# Altium schematic sheet MCU.SchDoc
size A3; SheetNumber: 13; SheetTotal: 18
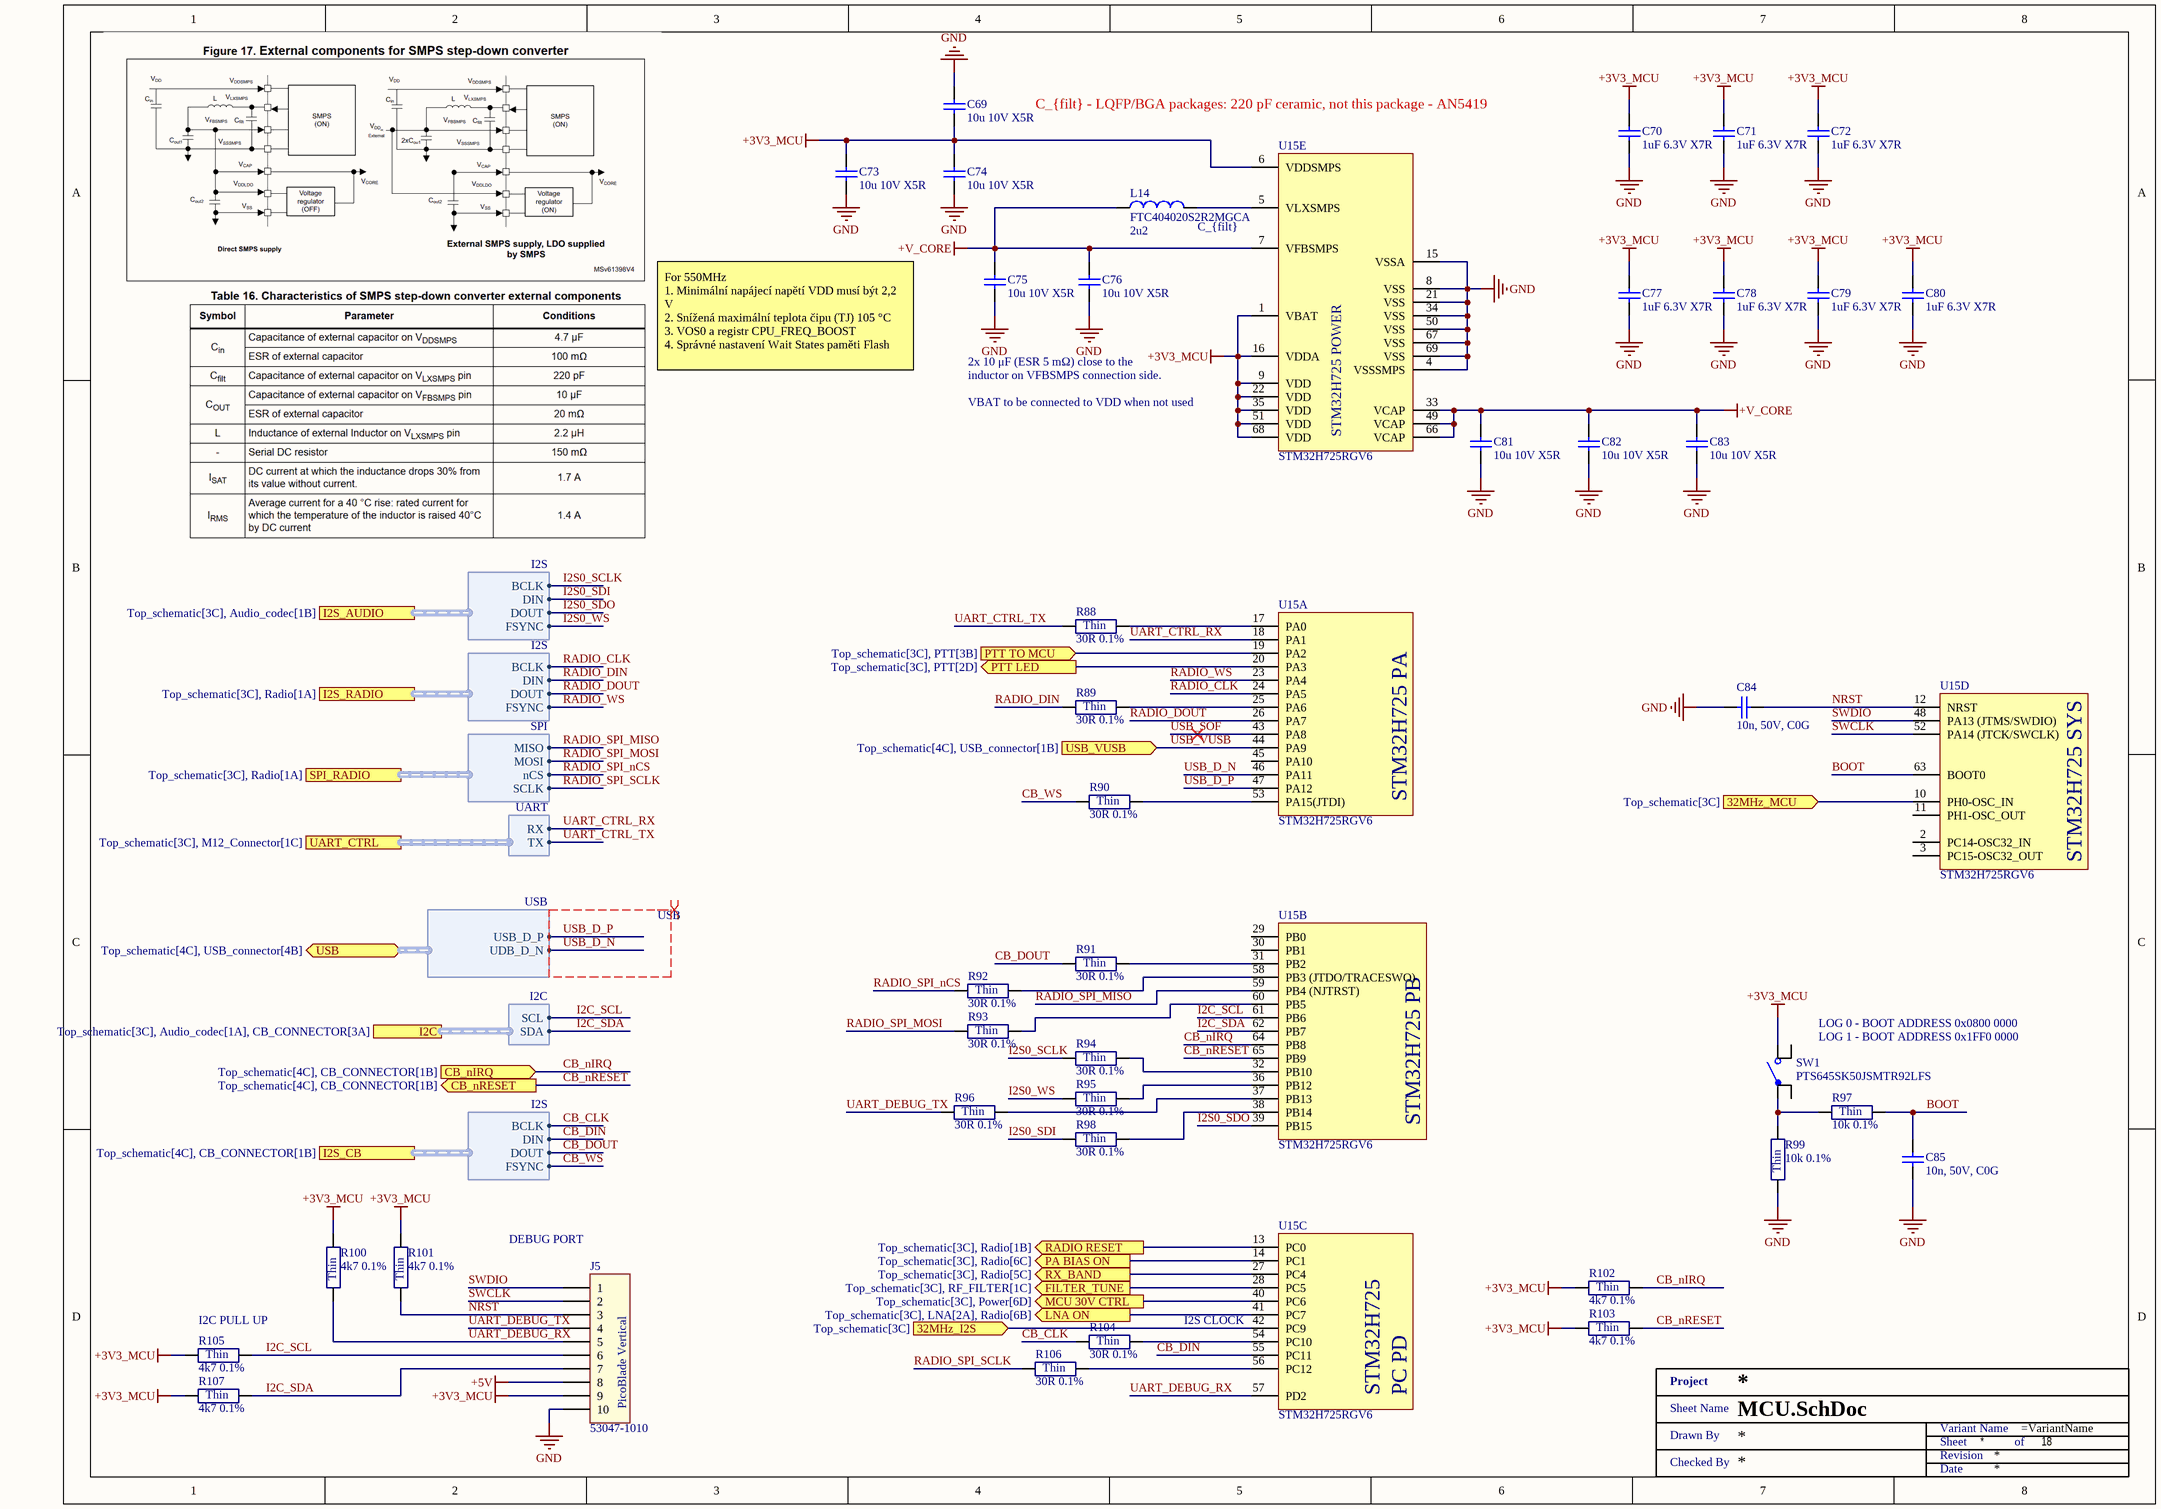
[diagram p0: MCU.SchDoc]

## Parts
C69  10u 10V X5R  [SMD0603]
C70  1uF 6.3V X7R  [SMD0402]
C71  1uF 6.3V X7R  [SMD0402]
C72  1uF 6.3V X7R  [SMD0402]
C73  10u 10V X5R  [SMD0603]
C74  10u 10V X5R  [SMD0603]
C75  10u 10V X5R  [SMD0603]
C76  10u 10V X5R  [SMD0603]
C77  1uF 6.3V X7R  [SMD0402]
C78  1uF 6.3V X7R  [SMD0402]
C79  1uF 6.3V X7R  [SMD0402]
C80  1uF 6.3V X7R  [SMD0402]
C81  10u 10V X5R  [SMD0603]
C82  10u 10V X5R  [SMD0603]
C83  10u 10V X5R  [SMD0603]
C84  10n, 50V, C0G  [SMD0603]
C85  10n, 50V, C0G  [SMD0603]
J5  53047-1010  [530471010]
L14  FTC404020S2R2MGCA  Inductance: 2u2  [FTC404020S]
R88  30R 0.1%  [SMD0402 - R]
R89  30R 0.1%  [SMD0402 - R]
R90  30R 0.1%  [SMD0402 - R]
R91  30R 0.1%  [SMD0402 - R]
R92  30R 0.1%  [SMD0402 - R]
R93  30R 0.1%  [SMD0402 - R]
R94  30R 0.1%  [SMD0402 - R]
R95  30R 0.1%  [SMD0402 - R]
R96  30R 0.1%  [SMD0402 - R]
R97  10k 0.1%  [SMD0402 - R]
R98  30R 0.1%  [SMD0402 - R]
R99  10k 0.1%  [SMD0402 - R]
R100  4k7 0.1%  [SMD0402 - R]
R101  4k7 0.1%  [SMD0402 - R]
R102  4k7 0.1%  [SMD0402 - R]
R103  4k7 0.1%  [SMD0402 - R]
R104  30R 0.1%  [SMD0402 - R]
R105  4k7 0.1%  [SMD0402 - R]
R106  30R 0.1%  [SMD0402 - R]
R107  4k7 0.1%  [SMD0402 - R]
SW1  PTS645SK50JSMTR92LFS  [J Square Actuator 6X6]
U15  STM32H725RGV6  [VFQFPN68-800X800X80_HS-69N]  (parts A,B,C,D,E of 5)
XX?  Title 1  (value not drawn)  (graphical)

## Ports
32MHz_I2S (in, see Top_schematic[3C]), 32MHz_MCU (in, see Top_schematic[3C]), CB_nIRQ (in, see Top_schematic[4C], CB_CONNECTOR[1B]), CB_nRESET (out, see Top_schematic[4C], CB_CONNECTOR[1B]), FILTER_TUNE (out, see Top_schematic[3C], RF_FILTER[1C]), I2C (harness I2C, see Top_schematic[3C], Audio_codec[1A], CB_CONNECTOR[3A]), I2S_AUDIO (harness I2S, see Top_schematic[3C], Audio_codec[1B]), I2S_CB (harness I2S, see Top_schematic[4C], CB_CONNECTOR[1B]), I2S_RADIO (harness I2S, see Top_schematic[3C], Radio[1A]), LNA ON (out, see Top_schematic[3C], LNA[2A], Radio[6B]), MCU 30V CTRL (out, see Top_schematic[3C], Power[6D]), PA BIAS ON (out, see Top_schematic[3C], Radio[6C]), PTT LED (out, see Top_schematic[3C], PTT[2D]), PTT TO MCU (in, see Top_schematic[3C], PTT[3B]), RADIO RESET (out, see Top_schematic[3C], Radio[1B]), RX_BAND (out, see Top_schematic[3C], Radio[5C]), SPI_RADIO (harness SPI, see Top_schematic[3C], Radio[1A]), UART_CTRL (harness UART, see Top_schematic[3C], M12_Connector[1C]), USB (bidir, harness USB, see Top_schematic[4C], USB_connector[4B]), USB_VUSB (in, see Top_schematic[4C], USB_connector[1B])

## Harnesses
I2S: BCLK, DIN, DOUT, FSYNC
SPI: MISO, MOSI, nCS, SCLK
UART: RX, TX
USB: USB_D_P, UDB_D_N
I2C: SCL, SDA

## Nets
+3V3_MCU: C69.1 C70.2 C71.2 C72.2 C73.2 C74.2 C77.2 C78.2 C79.2 C80.2 J5.9 R100.2 R101.2 R102.1 R103.1 R105.1 R107.1 SW1.3(C) U15.1(VBAT) U15.6(VDDSMPS) U15.9(VDD) U15.16(VDDA) U15.22(VDD) U15.35(VDD) U15.51(VDD) U15.68(VDD)
+5V: J5.8
+V_CORE: C75.2 C76.2 C81.2 C82.2 C83.2 L14.1 U15.7(VFBSMPS) U15.33(VCAP) U15.49(VCAP) U15.66(VCAP)
GND: C69.2 C70.1 C71.1 C72.1 C73.1 C74.1 C75.1 C76.1 C77.1 C78.1 C79.1 C80.1 C81.1 C82.1 C83.1 C84.2 C85.2 J5.10 R99.1 U15.4(VSSSMPS) U15.8(VSS) U15.15(VSSA) U15.21(VSS) U15.34(VSS) U15.50(VSS) U15.67(VSS) U15.69(VSS)
32MHz_I2S: U15.42(PC9) ; port 32MHz_I2S
32MHz_MCU: U15.10(PH0-OSC_IN) ; port 32MHz_MCU
BOOT: C85.1 R97.2 U15.63(BOOT0)
CB_CLK: R104.1 ; port I2S_CB.BCLK
CB_DIN: U15.55(PC11) ; port I2S_CB.DIN
CB_DOUT: R91.1 ; port I2S_CB.DOUT
CB_nIRQ: R102.2 U15.64(PB8) ; port CB_nIRQ
CB_nRESET: R103.2 U15.65(PB9) ; port CB_nRESET
CB_WS: R90.1 ; port I2S_CB.FSYNC
FILTER_TUNE: U15.28(PC5) ; port FILTER_TUNE
I2C_SCL: J5.6 R105.2 U15.61(PB6) ; port I2C.SCL
I2C_SDA: J5.7 R107.2 U15.62(PB7) ; port I2C.SDA
I2S0_SCLK: R94.1 ; port I2S_AUDIO.BCLK
I2S0_SDI: R98.1 ; port I2S_AUDIO.DIN
I2S0_SDO: U15.39(PB15) ; port I2S_AUDIO.DOUT
I2S0_WS: R95.1 ; port I2S_AUDIO.FSYNC
LNA ON: U15.41(PC7) ; port LNA ON
MCU 30V CTRL: U15.40(PC6) ; port MCU 30V CTRL
NRST: C84.1 J5.3 R101.1 U15.12(NRST)
PA BIAS ON: U15.14(PC1) ; port PA BIAS ON
PTT LED: U15.20(PA3) ; port PTT LED
PTT TO MCU: U15.19(PA2) ; port PTT TO MCU
RADIO RESET: U15.13(PC0) ; port RADIO RESET
RADIO_CLK: U15.24(PA5) ; port I2S_RADIO.BCLK
RADIO_DIN: R89.1 ; port I2S_RADIO.DIN
RADIO_DOUT: U15.26(PA7) ; port I2S_RADIO.DOUT
RADIO_SPI_MISO: U15.59(PB4_(NJTRST)) ; port SPI_RADIO.MISO
RADIO_SPI_MOSI: R93.1 ; port SPI_RADIO.MOSI
RADIO_SPI_nCS: R92.1 ; port SPI_RADIO.nCS
RADIO_SPI_SCLK: R106.1 ; port SPI_RADIO.SCLK
RADIO_WS: U15.23(PA4) ; port I2S_RADIO.FSYNC
RX_BAND: U15.27(PC4) ; port RX_BAND
SWCLK: J5.2 U15.52(PA14_(JTCK/SWCLK))
SWDIO: J5.1 U15.48(PA13_(JTMS/SWDIO))
UART_CTRL_RX: U15.18(PA1) ; port UART_CTRL.RX
UART_CTRL_TX: R88.1 ; port UART_CTRL.TX
UART_DEBUG_RX: J5.5 R100.1 U15.57(PD2)
UART_DEBUG_TX: J5.4 R96.1
USB_D_N: U15.46(PA11) ; port USB.UDB_D_N
USB_D_P: U15.47(PA12) ; port USB.USB_D_P
USB_SOF: U15.43(PA8)
USB_VUSB: U15.44(PA9) ; port USB_VUSB
NetL14_2: L14.2 U15.5(VLXSMPS)
NetR88_2: R88.2 U15.17(PA0)
NetR89_2: R89.2 U15.25(PA6)
NetR90_2: R90.2 U15.53(PA15(JTDI))
NetR91_2: R91.2 U15.31(PB2)
NetR92_2: R92.2 U15.58(PB3_(JTDO/TRACESWO))
NetR93_2: R93.2 U15.60(PB5)
NetR94_2: R94.2 U15.32(PB10)
NetR95_2: R95.2 U15.36(PB12)
NetR96_2: R96.2 U15.37(PB13)
NetR97_1: R97.1 R99.2 SW1.1(A)
NetR98_2: R98.2 U15.38(PB14)
NetR104_2: R104.2 U15.54(PC10)
NetR106_2: R106.2 U15.56(PC12)

Not connected (* = marked no-connect by the designer): SW1 2(B) 4(D); U15 2(PC14-OSC32_IN) 3(PC15-OSC32_OUT) 11(PH1-OSC_OUT) 29(PB0) 30(PB1) 45(PA10)

## Layout directives
differential pair; differential pair class USB: USB_D_N, USB_D_P

## Notes on the sheet
- C_{filt} - LQFP/BGA packages: 220 pF ceramic, not this package - AN5419
- C_{filt}
- For 550MHz
  1. Minimální napájecí napětí VDD musí být 2,2 V
  2. Snížená maximální teplota čipu (TJ) 105 °C
  3. VOS0 a registr CPU_FREQ_BOOST
  4. Správné nastavení Wait States paměti Flash
- 2x 10 μF (ESR 5 mΩ) close to the
- inductor on VFBSMPS connection side.
- VBAT to be connected to VDD when not used
- (near SW1) LOG 0 - BOOT ADDRESS 0x0800 0000
- (near SW1) LOG 1 - BOOT ADDRESS 0x1FF0 0000
- (near J5) DEBUG PORT
- (near R105) I2C PULL UP
- I2S CLOCK
- (in symbol 53047-1010) PicoBlade Vertical
- (in symbol RT0402BRD074K7L) Thin
- (in symbol STM32H725RGV6, part A) STM32H725 PA
- (in symbol STM32H725RGV6, part B) STM32H725 PB
- (in symbol STM32H725RGV6, part C) STM32H725; PC PD
- (in symbol STM32H725RGV6, part D) STM32H725 SYS
- (in symbol STM32H725RGV6, part E) STM32H725 POWER
- (in symbol TC0225B300JTCC) Thin
- (in symbol TC0225B1002TCC) Thin
- (in symbol Title 1) Project; Sheet Name; Variant Name; Drawn By; Sheet; of; Revision; Checked By; Date

## Library data of the parts
C69 C73-C76 C81-C83 = TCC0603X5R106K100CT: Multilayer Ceramic Capacitor (MLCC) 10uF ±10% 10V X5R 0603 SMD, CCTC TCC Series; Capacitance: 10u; Supplier 1: LCSC; Supplier Part Number 1: C380314
C70-C72 C77-C80 = TCC0402X7R105K6R3AT: Capacitor: MLCC; SMD; 0402; 1µF; 6.3V; ±10%; X7R; CCTC; Capacitance: 1u; Supplier 1: LCSC; Supplier Part Number 1: C5448871; Manufacturer: CCTC; Manufacturer Part Number: TCC0402X7R105K6R3AT; Category: Ceramic Capacitors; Stock 1: 242350; Pricing 1: 50=0.0089, 500=0.0072, 1500=0.0063, 10000=0.0058, 20000=0.0053, 50000=0.005 (USD); ComponentLink1URL: https://datasheet.octopart.com:443/TCC0402X7R105K6R3AT-CCTC-datasheet-194166649.pdf?src-supplier=LCSC; ComponentLink1Description: https://datasheet.octopart.com:443/TCC0402X7R105K6R3AT-CCTC-datasheet-194166649.pdf?src-supplier=LCSC; ComponentLink2URL: https://datasheet.octopart.com:443/TCC0402X7R105K6R3AT-CCTC-datasheet-192317456.pdf?src-supplier=HQonline; ComponentLink2Description: https://datasheet.octopart.com:443/TCC0402X7R105K6R3AT-CCTC-datasheet-192317456.pdf?src-supplier=HQonline
C84 C85 = GRM1885C1H103JA01D: Multilayer Ceramic Capacitors MLCC - SMD/SMT 0603 50VDC 10000pF 5% C0G; Manufacturer: Murata Electronics; Type: Chip Multilayer Ceramic Capacitor for General Purpose; Capacitance - nF: 10 nF; Class: Class 1; CNHTS: 8532241000; Dielectric: C0G (NP0); TARIC: 8532240000; Supplier 1: Mouser; Supplier Part Number 1: 81-GRM1885C1H103JA1D; Manufacturer Part Number: GRM1885C1H103JA01D; RoHS: RoHS Compliant; Category: Multilayer Ceramic Capacitors MLCC - SMD/SMT; Stock 1: 217291; Pricing 1: 1=0.183, 10=0.129, 100=0.065, 500=0.045, 1000=0.039, 4000=0.030, 8000=0.027, 24000=0.025 (EUR); Capacitance: 10n; Height: 0.8 mm; Length: 1.6 mm; Package / Case: 0603 (1608 metric); Packaging: Cut Tape; Product: General Type MLCCs; Series: GRM; Termination Style: SMD/SMT; Tolerance: 5 %; Voltage Rating DC: 50 VDC; Width: 0.8 mm; Brand: Murata Electronics; Capacitance - pF: 10000 pF; Case Code - in: 0603; Case Code - mm: 1608; HTS Code: 8532240020; Maximum Operating Temperature: + 125 C; Minimum Operating Temperature: - 55 C; Product Type: Ceramic Capacitors; Standard Pack Qty: 4000; Subcategory: Capacitors; Termination: Standard; RoHS - Mouser: Y; Minimum Order Quantity: 1; Reeling: True; ComponentLink1URL: http://www.mouser.com/datasheet/2/281/murata_03052018_GRM_Series_1-1310166.pdf; ComponentLink1Description: http://www.mouser.com/datasheet/2/281/murata_03052018_GRM_Series_1-1310166.pdf; Supplier 2: Farnell; Supplier Part Number 2: 2456107
J5 = 53047-1010: 1.25mm Pitch, PicoBlade PCB Header, Single Row, Vertical, Through Hole, Tin Plating, Friction Lock, 10 Circuits, Tray, 2.30mm PC Tail Length; Manufacturer: Molex; Number of Contacts: 10; Max Voltage Rating (DC): 125.125kV; Max Voltage Rating (AC): 125V; Current Rating: 1A; Contact Resistance: 20MR; Insulation Resistance: 100MR; Glow Wire Compliant: Non-compliant; Connector Type: Blade Pin; Supplier 1: Mouser; Supplier Part Number 1: 538-53047-1010; Manufacturer Part Number: 53047-1010; Stock 1: 9729; Pricing 1: 1 = 0.50000, 10 = 0.48800, 50 = 0.48800, 100 = 0.37400, 1000 = 0.26800, 10000 = 0.21600 (USD); RoHS: Yes; Mount: Through Hole; Contact Plating: Tin; Contact Material: Bronze; Housing Color: White; Color: Natural; Housing Material: Nylon; Body Plating: Tin; Plating: Tin; Min Operating Temperature: -40°C; Max Operating Temperature: 85°C; Termination: Solder; Number of Rows: 1; Orientation: Vertical; Packaging: Tray; Number of Positions: 10; Package Quantity: 2000; Voltage Rating: 125V; Max Current Rating: 1A; Number of Poles: 10; Voltage Rating (AC): 125V; Contact Gender: Male; Working Voltage: 125V; Current: 1A; Voltage: 125V; Number of Circuits: 10; Voltage Rating (DC): 125V; Length: 14.25mm; Height: 4.2mm; Pitch: 1.25mm; Depth: 3.2mm; Lead Pitch: 1.25mm; Radiation Hardening: No; REACH SVHC: Unknown; Lead Free: Lead Free; Flammability Rating: UL94 V-0; ComponentLink1URL: https://datasheet.ciiva.com/5151/0530471010-pcb-headers-171035-5151940.pdf?src-supplier=Mouser; ComponentLink1Description: https://datasheet.ciiva.com/5151/0530471010-pcb-headers-171035-5151940.pdf?src-supplier=Mouser; ComponentLink2URL: https://datasheet.ciiva.com/30250/7280530471010-pcb-headers-30250345.pdf?src-supplier=Onlinecomponents.com; ComponentLink2Description: https://datasheet.ciiva.com/30250/7280530471010-pcb-headers-30250345.pdf?src-supplier=Onlinecomponents.com; ComponentLink3URL: https://datasheet.ciiva.com/11747/0900766b8024e2fd-11747087.pdf?src-supplier=RSComponents; ComponentLink3Description: https://datasheet.ciiva.com/11747/0900766b8024e2fd-11747087.pdf?src-supplier=RSComponents; ComponentLink4URL: https://datasheet.ciiva.com/19461/2033252-19461670.pdf?src-supplier=Jameco; ComponentLink4Description: https://datasheet.ciiva.com/19461/2033252-19461670.pdf?src-supplier=Jameco; ComponentLink5URL: https://datasheet.ciiva.com/10083/0530471010-pcb-headers-10083962.pdf?src-supplier=Avnet; ComponentLink5Description: https://datasheet.ciiva.com/10083/0530471010-pcb-headers-10083962.pdf?src-supplier=Avnet; ComponentLink6URL: https://datasheet.ciiva.com/20207/22-3930e-20207531.pdf?src-supplier=Rapid+Electronics; ComponentLink6Description: https://datasheet.ciiva.com/20207/22-3930e-20207531.pdf?src-supplier=Rapid+Electronics; Supplier 2: Arrow; Supplier Part Number 2: 53047-1010; Stock 2: 19420; Pricing 2: 1 = 0.41890, 10 = 0.39900, 100 = 0.30530, 500 = 0.27600, 1000 = 0.24010, 8000 = 0.20770, 1 = 0.56870, 10 = 0.52970, 100 = 0.36620, 500 = 0.31550, 1000 = 0.26830, 100 = 0.37250 (USD); Supplier 3: Digi-Key; Supplier Part Number 3: WM1739-ND; Stock 3: 4931; Pricing 3: 1 = 0.52000, 10 = 0.48900, 100 = 0.37470, 500 = 0.32580, 1000 = 0.26879, 8000 = 0.21992, 16000 = 0.21666 (USD); Supplier 4: Farnell; Supplier Part Number 4: 9733086; Stock 4: 12753; Supplier 5: Mouser; Supplier Part Number 5: 538-53047-0410; Category: Headers and Wire Housings; Stock 5: 7971; Pricing 5: 1=0,27000, 10=0,23400, 100=0,18000, 500=0,15400, 1000=0,13000, 5000=0,11200, 10000=0,10400 (USD); Contact Mating Length: 0.089inch; ComponentLink7URL: https://datasheet.ciiva.com/3934/87920530470410-pcb-headers-3934064.pdf?src-supplier=Arrow; ComponentLink7Description: https://datasheet.ciiva.com/3934/87920530470410-pcb-headers-3934064.pdf?src-supplier=Arrow
L14 = FTC404020S2R2MGCA: FIXED IND 2.2uH 5.5A 36mΩ SMD,4.1x4.1mm; Manufacturer: Cjiang; Supplier 1: LCSC; Supplier Part Number 1: C39676070; Manufacturer Part Number: FTC404020S2R2MGCA; Category: Uncategorized; Stock 1: 6495; Pricing 1: 5=0.2588, 50=0.1952, 150=0.1679, 500=0.134, 3000=0.1188, 6000=0.1097 (USD)
R88-R96 R98 R104 R106 = TC0225B300JTCC: Resistor: thin film; SMD; 0402; 30Ω; 62.5mW; ±0.1%; TC25; 25V; -55÷155°C; Manufacturer: Uniroyal; Supplier 1: LCSC; Supplier Part Number 1: C50670254; Manufacturer Part Number: TC0225B300JTCC; Category: Uncategorized; Stock 1: 4950; Pricing 1: 50=0.0203, 500=0.0161, 1500=0.0137, 10000=0.0123, 20000=0.0111, 50000=0.0104 (USD); ComponentLink1URL: https://datasheet.octopart.com:443/TC0225B300JTCC-Uniroyal-datasheet-194228366.pdf?src-supplier=LCSC; ComponentLink1Description: https://datasheet.octopart.com:443/TC0225B300JTCC-Uniroyal-datasheet-194228366.pdf?src-supplier=LCSC; Resistance: 30R
R97 R99 = TC0225B1002TCC: Fixed Resistor, Thin Film, 0.0625W, 10000ohm, 50V, 0.1% +/-Tol, Surface Mount, 0402; Manufacturer: Uniroyal; Power Rating: 62.5mW; Supplier 1: LCSC; Supplier Part Number 1: C2989267; Manufacturer Part Number: TC0225B1002TCC; Category: Chip SMD Resistors; Stock 1: 10200; Pricing 1: 20=0.0396, 200=0.0352, 600=0.0327, 2000=0.0312, 10000=0.0299, 20000=0.0292 (USD); Case/Package: 0402; Composition: Thin Film; Export Control Classification Number (ECCN) Code: EAR99; Height: 300µm; Harmonized Tariff Schedule (HTS) Code: 8533.21.00.30; Length: 1mm; Lifecycle Status: Production; Max Operating Temperature: 155°C; Min Operating Temperature: -55°C; Mounting Technology: Surface Mount; Number of Terminals: 2; Resistance: 10k; Tolerance: 0.1%; Width: 500µm; Working Voltage: 50V; ComponentLink1URL: https://datasheet.octopart.com:443/TC0225B1002TCC-Uniroyal-datasheet-194228365.pdf?src-supplier=LCSC; ComponentLink1Description: https://datasheet.octopart.com:443/TC0225B1002TCC-Uniroyal-datasheet-194228365.pdf?src-supplier=LCSC
R100-R103 R105 R107 = RT0402BRD074K7L: 62.5mW Thin Film Resistor 50V ±25ppm/℃ ±0.1% 4.7kΩ 0402 Chip Resistor - Surface Mount ROHS; Manufacturer: Yageo Group; Max Power Dissipation: 63mW; Temperature Coefficient: 25ppm/°C; Supplier: Mouser; Supplier Part Number: 603-RT0402BRD074K7L; Manufacturer Part Number: RT0402BRD074K7L; RoHS: Compliant; Category: Chip SMD Resistors; Stock: 24860; Pricing: 1=0,1, 10=0,069, 50=0,069, 100=0,065, 1000=0,054, 10000=0,048 (USD); Case/Package: 0402; Case Code (Imperial): 0402; China RoHS: Non-Compliant; Composition: Thin Film; Depth: 500µm; Features: Moisture Resistant; Height: 300µm; Lead Free: Lead Free; Length: 1mm; Lifecycle Status: Production; Max Operating Temperature: 155°C; Military Standard: Not; Min Operating Temperature: -55°C; Mounting Technology: Surface Mount; Number of Terminals: 2; Number of Terminations: 2; Power Rating: 62.5mW; REACH SVHC: Yes; Schedule B: 8533210045, 8533210045|8533210045|8533210045|8533210045|8533210045; Termination: SMD/SMT; Tolerance: 0.1%; Voltage Rating: 50V; Voltage Rating (DC): 50V; Width: 500µm; Working Voltage: 50V; ComponentLink1URL: https://datasheet.octopart.com:443/RT0402BRD074K7L-Yageo-datasheet-176402239.pdf?src-supplier=Future+Electronics; ComponentLink1Description: https://datasheet.octopart.com:443/RT0402BRD074K7L-Yageo-datasheet-176402239.pdf?src-supplier=Future+Electronics; ComponentLink2URL: https://datasheet.octopart.com:443/RT0402BRD074K7L-Yageo-datasheet-169971040.pdf?src-supplier=Future+Electronics; ComponentLink2Description: https://datasheet.octopart.com:443/RT0402BRD074K7L-Yageo-datasheet-169971040.pdf?src-supplier=Future+Electronics; ComponentLink3URL: https://datasheet.octopart.com:443/RT0402BRD074K7L-Yageo-datasheet-166250672.pdf?src-supplier=Future+Electronics; ComponentLink3Description: https://datasheet.octopart.com:443/RT0402BRD074K7L-Yageo-datasheet-166250672.pdf?src-supplier=Future+Electronics; ComponentLink4URL: https://datasheet.octopart.com:443/RT0402BRD074K7L-Yageo-datasheet-136673517.pdf?src-supplier=Future+Electronics; ComponentLink4Description: https://datasheet.octopart.com:443/RT0402BRD074K7L-Yageo-datasheet-136673517.pdf?src-supplier=Future+Electronics; ComponentLink5URL: https://datasheet.octopart.com:443/RT0402BRD074K7L-Yageo-datasheet-137700930.pdf?src-supplier=Future+Electronics; ComponentLink5Description: https://datasheet.octopart.com:443/RT0402BRD074K7L-Yageo-datasheet-137700930.pdf?src-supplier=Future+Electronics; ComponentLink6URL: https://datasheet.octopart.com:443/RT0402BRD074K7L-Yageo-datasheet-96443642.pdf?src-supplier=Upverter; ComponentLink6Description: https://datasheet.octopart.com:443/RT0402BRD074K7L-Yageo-datasheet-96443642.pdf?src-supplier=Upverter; ComponentLink7URL: https://datasheet.octopart.com:443/RT0402BRD074K7L-Yageo-Group-datasheet-188167888.pdf?src-supplier=TME; ComponentLink7Description: https://datasheet.octopart.com:443/RT0402BRD074K7L-Yageo-Group-datasheet-188167888.pdf?src-supplier=TME; ComponentLink8URL: https://datasheet.octopart.com:443/RT0402BRD074K7L-Yageo-datasheet-164439670.pdf?src-supplier=Newark; ComponentLink8Description: https://datasheet.octopart.com:443/RT0402BRD074K7L-Yageo-datasheet-164439670.pdf?src-supplier=Newark; ComponentLink9URL: https://datasheet.octopart.com/RT0402BRD074K7L-Yageo-datasheet-86813807.pdf; ComponentLink9Description: https://datasheet.octopart.com/RT0402BRD074K7L-Yageo-datasheet-86813807.pdf; ComponentLink10URL: http://sigma.octopart.com:80/conflict_mineral_statement/Yageo-company-3.pdf?src-supplier=Compliance+Statements; ComponentLink10Description: http://sigma.octopart.com:80/conflict_mineral_statement/Yageo-company-3.pdf?src-supplier=Compliance+Statements; ComponentLink11URL: http://sigma.octopart.com:80/rohs_statement/Yageo-company-2.pdf?src-supplier=Compliance+Statements; ComponentLink11Description: http://sigma.octopart.com:80/rohs_statement/Yageo-company-2.pdf?src-supplier=Compliance+Statements; Supplier 1: Mouser; Supplier Part Number 1: 603-RT0402BRD074K7L; Supplier 2: LCSC; Supplier Part Number 2: C281778; Resistance: 4k7
SW1 = PTS645SK50JSMTR92LFS: Switch Tactile SPST N.O Round Button 12V 50mA 2.5N Solder Surface Mount T/R; Manufacturer: C&K Components; Supplier: Mouser; Supplier Part Number: 611-SK50JSMTR92LFS; Manufacturer Part Number: PTS645SK50JSMTR92LFS; RoHS: Compliant; Category: Tactile Switches; Stock: 6240; Pricing: 1=0,51, 10=0,437, 50=0,408, 100=0,364, 1000=0,268, 10000=0,234 (USD); Export Control Classification Number (ECCN) Code: EAR99; Harmonized Tariff Schedule (HTS) Code: 8536.50.70.00; Introduction Date: 2022-04-14; Lifecycle Status: Production; REACH SVHC: Yes; ComponentLink1URL: https://datasheet.octopart.com:443/PTS645SK50JSMTR92LFS-C%26K-Components-datasheet-169841344.pdf?src-supplier=IHS; ComponentLink1Description: https://datasheet.octopart.com:443/PTS645SK50JSMTR92LFS-C%26K-Components-datasheet-169841344.pdf?src-supplier=IHS; ComponentLink2URL: https://datasheet.octopart.com:443/PTS645SK50JSMTR92LFS-C%26K-Components-datasheet-165782998.pdf?src-supplier=Farnell; ComponentLink2Description: https://datasheet.octopart.com:443/PTS645SK50JSMTR92LFS-C%26K-Components-datasheet-165782998.pdf?src-supplier=Farnell; ComponentLink3URL: https://datasheet.octopart.com:443/PTS645SK50JSMTR92LFS-C%26K-Components-datasheet-155912617.pdf?src-supplier=Sager+Electronics; ComponentLink3Description: https://datasheet.octopart.com:443/PTS645SK50JSMTR92LFS-C%26K-Components-datasheet-155912617.pdf?src-supplier=Sager+Electronics; ComponentLink4URL: https://datasheet.octopart.com:443/PTS645SK50JSMTR92LFS-C%26K-Components-datasheet-150821959.pdf?src-supplier=Sager+Electronics; ComponentLink4Description: https://datasheet.octopart.com:443/PTS645SK50JSMTR92LFS-C%26K-Components-datasheet-150821959.pdf?src-supplier=Sager+Electronics; ComponentLink5URL: https://datasheet.octopart.com:443/PTS645SK50JSMTR92LFS-C%26K-Components-datasheet-67873720.pdf?src-supplier=Sager+Electronics; ComponentLink5Description: https://datasheet.octopart.com:443/PTS645SK50JSMTR92LFS-C%26K-Components-datasheet-67873720.pdf?src-supplier=Sager+Electronics; ComponentLink6URL: http://sigma.octopart.com:80/reach_statement/ITT-company-18.pdf?src-supplier=Compliance+Statements; ComponentLink6Description: http://sigma.octopart.com:80/reach_statement/ITT-company-18.pdf?src-supplier=Compliance+Statements; Supplier 1: Mouser; Supplier Part Number 1: 611-SK50JSMTR92LFS; Supplier 2: Farnell; Supplier Part Number 2: PTS645SK50JSMTR92LFS
U15 = STM32H725RGV6: RISC Microcontroller, 32-Bit, FLASH, CORTEX-M7 CPU, 550MHz, CMOS; Manufacturer: STMicroelectronics; ADC Channels (Resolution): 2-Ch 12-Bit, 26-Ch 16-Bit; DAC Channels (Resolution): 2-Ch 12-Bit; EEPROM Memory Size: 0B; Flash Memory Size: 1MB; Interface: USB; Max Supply Current: 360mA; Max Supply Voltage: 3.6V; Min Supply Voltage: 1.71V; Nominal Supply Current: 4µA; Nominal Supply Voltage (DC): 1.8V; Number of A/D Converters: 1; Number of Channels: 2; Number of I2C Channels: 4; Number of I/Os: 10; Number of Timers/Counters: 24; Peripherals: LCD, POR; RAM Size: 564kB; Supplier: Mouser; Supplier Part Number: 511-STM32H725RGV6; Manufacturer Part Number: STM32H725RGV6; RoHS: Compliant; Category: Microcontrollers; Stock: 1387; Pricing: 1=11,35, 10=8,88, 50=8,26, 100=7,59, 1000=6,95, 10000=6,95 (USD); China RoHS: Compliant; Frequency: 550MHz; Height - Seated (Max): 1mm; Length: 8mm; Lifecycle Status: Production; Clock Frequency: 550MHz; Max Operating Temperature: 85°C; Memory Format: FLASH; Min Operating Temperature: -40°C; Number of D/A Converters: 2; Number of SPI Channels: 4; Number of Terminals: 68; Number of UART Channels: 4; Number of USART Channels: 4; REACH SVHC: Yes; Terminal Pitch: 400µm; Width: 8mm; Supplier 1: Mouser; Supplier Part Number 1: 511-STM32H725RGV6; Supplier 2: LCSC; Supplier Part Number 2: C5271073; Supplier 3: Farnell; Supplier Part Number 3: STM32H725RGV6